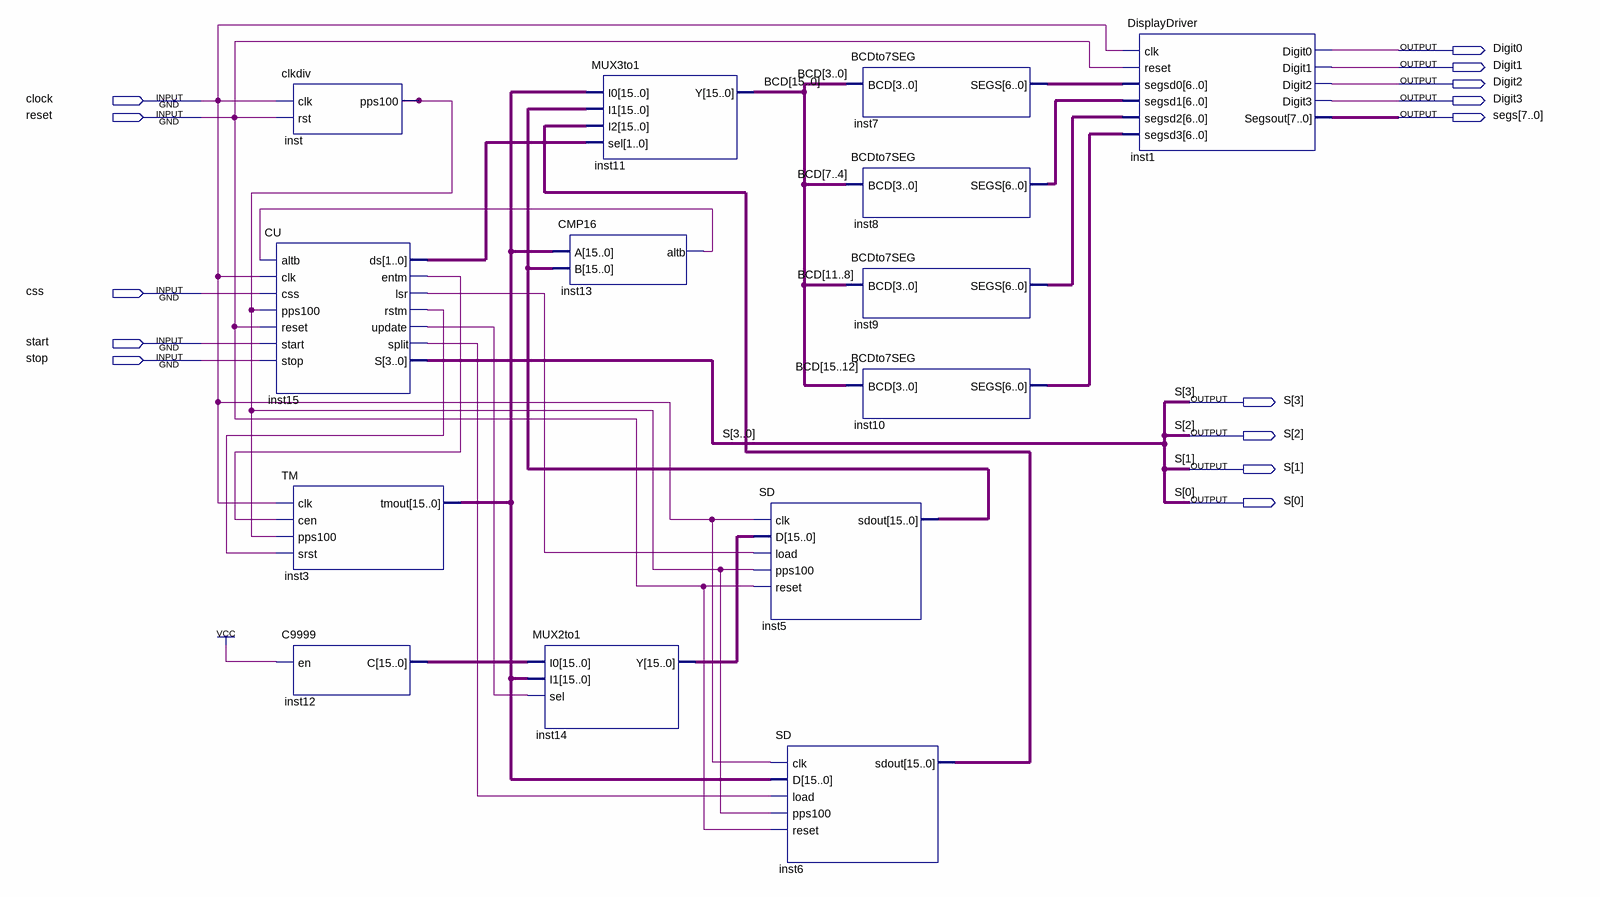
[diagram p0: schematic sheet]
// Quartus schematic stopwatch.bdf as structural Verilog: 14 symbols, 14 pins
module stopwatch (
  input  clock,
  input  reset,
  input  css,
  input  start,
  input  stop,
  output Digit0,
  output Digit1,
  output Digit2,
  output Digit3,
  output [7:0] segs,
  output [3:0] S
);

  wire inst13_altb, inst15_entm, inst15_lsr, inst15_rstm, inst15_split, inst15_update, inst_pps100;
  wire [1:0] inst15_ds;
  wire [6:0] inst7_segs, inst8_segs, inst9_segs, inst10_segs;
  wire [15:0] BCD, inst3_tmout, inst5_sdout, inst6_sdout, inst12_c, inst14_y;

  clkdiv inst (.clk(clock), .rst(reset), .pps100(inst_pps100));
  CU inst15 (
    .altb(inst13_altb), .clk(clock), .css(css), .pps100(inst_pps100), .reset(reset), .start(start),
    .stop(stop), .ds(inst15_ds), .entm(inst15_entm), .lsr(inst15_lsr), .rstm(inst15_rstm),
    .update(inst15_update), .split(inst15_split), .S(S));
  TM inst3 (.clk(clock), .cen(inst15_entm), .pps100(inst_pps100), .srst(inst15_rstm), .tmout(inst3_tmout));
  C9999 inst12 (.en(1'b1), .C(inst12_c));
  CMP16 inst13 (.A(inst3_tmout), .B(inst5_sdout), .altb(inst13_altb));
  MUX2to1 inst14 (.I0(inst12_c), .I1(inst3_tmout), .sel(inst15_update), .Y(inst14_y));
  MUX3to1 inst11 (.I0(inst3_tmout), .I1(inst5_sdout), .I2(inst6_sdout), .sel(inst15_ds), .Y(BCD));
  SD inst5 (.clk(clock), .D(inst14_y), .load(inst15_lsr), .pps100(inst_pps100), .reset(reset), .sdout(inst5_sdout));
  SD inst6 (
    .clk(clock), .D(inst3_tmout), .load(inst15_split), .pps100(inst_pps100), .reset(reset),
    .sdout(inst6_sdout));
  BCDto7SEG inst7 (.BCD(BCD[3:0]), .SEGS(inst7_segs));
  BCDto7SEG inst8 (.BCD(BCD[7:4]), .SEGS(inst8_segs));
  BCDto7SEG inst9 (.BCD(BCD[11:8]), .SEGS(inst9_segs));
  BCDto7SEG inst10 (.BCD(BCD[15:12]), .SEGS(inst10_segs));
  DisplayDriver inst1 (
    .clk(clock), .reset(reset), .segsd0(inst7_segs), .segsd1(inst8_segs), .segsd2(inst9_segs),
    .segsd3(inst10_segs), .Digit0(Digit0), .Digit1(Digit1), .Digit2(Digit2), .Digit3(Digit3), .Segsout(segs));
endmodule
